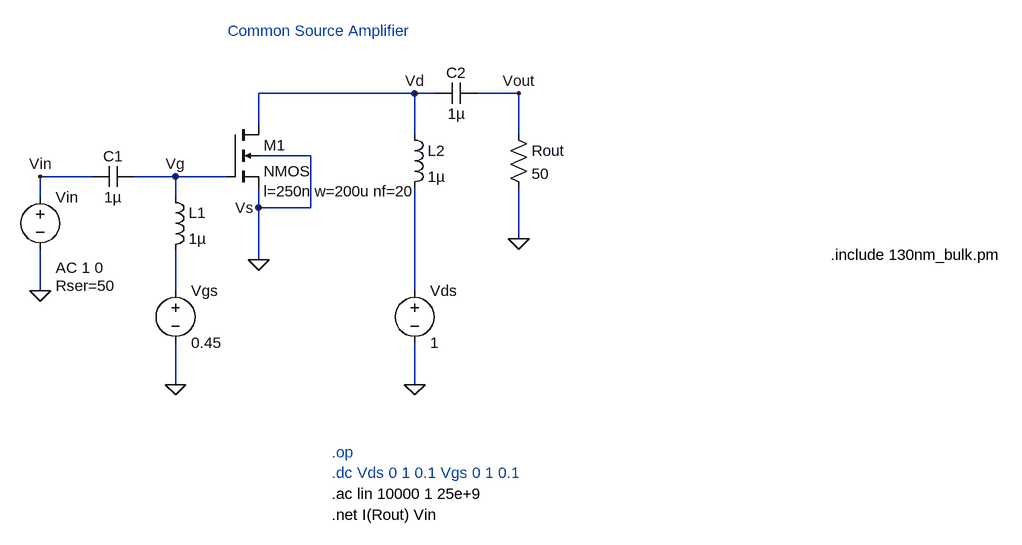
[diagram p0: schematic Common_Source_Amplifier.asc]
Common_Source_Amplifier.asc, the LTspice schematic file:
Version 4
SHEET 1 1540 744
WIRE 448 32 208 32
WIRE 480 32 448 32
WIRE 608 32 544 32
WIRE 208 80 208 32
WIRE 448 96 448 32
WIRE 608 96 608 32
WIRE 288 128 208 128
WIRE -48 160 -128 160
WIRE 80 160 16 160
WIRE 160 160 80 160
WIRE -128 192 -128 160
WIRE 80 192 80 160
WIRE 208 208 208 176
WIRE 288 208 288 128
WIRE 288 208 208 208
WIRE 608 256 608 176
WIRE 208 288 208 208
WIRE -128 336 -128 272
WIRE 80 336 80 272
WIRE 448 336 448 176
WIRE 80 480 80 416
WIRE 448 480 448 416
FLAG -128 336 0
FLAG 80 480 0
FLAG 448 480 0
FLAG 208 288 0
FLAG 608 256 0
FLAG 208 208 Vs
FLAG 80 160 Vg
FLAG 448 32 Vd
FLAG 608 32 Vout
FLAG -128 160 Vin
SYMBOL nmos4 160 80 R0
WINDOW 123 56 103 Left 2
SYMATTR Value2 l=250n w=200u nf=20
SYMATTR InstName M1
SYMBOL ind 64 176 R0
SYMATTR InstName L1
SYMATTR Value 1µ
SYMBOL ind 432 80 R0
SYMATTR InstName L2
SYMATTR Value 1µ
SYMBOL cap 16 144 R90
WINDOW 0 0 32 VBottom 2
WINDOW 3 32 32 VTop 2
SYMATTR InstName C1
SYMATTR Value 1µ
SYMBOL cap 544 16 R90
WINDOW 0 0 32 VBottom 2
WINDOW 3 32 32 VTop 2
SYMATTR InstName C2
SYMATTR Value 1µ
SYMBOL res 592 80 R0
SYMATTR InstName Rout
SYMATTR Value 50
SYMBOL voltage -128 176 R0
WINDOW 123 24 124 Left 2
WINDOW 39 24 152 Left 2
SYMATTR Value2 AC 1 0
SYMATTR SpiceLine Rser=50
SYMATTR InstName Vin
SYMATTR Value ""
SYMBOL voltage 80 320 R0
WINDOW 123 0 0 Left 0
WINDOW 39 0 0 Left 0
SYMATTR InstName Vgs
SYMATTR Value 0.45
SYMBOL voltage 448 320 R0
WINDOW 123 0 0 Left 0
WINDOW 39 0 0 Left 0
SYMATTR InstName Vds
SYMATTR Value 1
TEXT 160 -64 Left 2 ;Common Source Amplifier
TEXT 320 584 Left 2 ;.op
TEXT 320 616 Left 2 ;.dc Vds 0 1 0.1 Vgs 0 1 0.1
TEXT 320 648 Left 2 !.ac lin 10000 1 25e+9
TEXT 320 680 Left 2 !.net I(Rout) Vin
TEXT 1088 280 Left 2 !.include 130nm_bulk.pm

The netlist it stands for:
* Common_Source_Amplifier.asc
M1 Vd Vg 0 0 NMOS l=250n w=200u nf=20
L1 Vg N001 1µ
L2 Vd N002 1µ
C1 Vg Vin 1µ
C2 Vout Vd 1µ
Rout Vout 0 50
Vin Vin 0 AC 1 0 Rser=50
Vgs N001 0 0.45
Vds N002 0 1
.model NMOS NMOS
.model PMOS PMOS
.lib standard.mos
* Common Source Amplifier
* .op
* .dc Vds 0 1 0.1 Vgs 0 1 0.1
.ac lin 10000 1 25e+9
.net I(Rout) Vin
.include 130nm_bulk.pm
.backanno
.end